# Altium schematic sheet big-auv-power.SchDoc
size A2
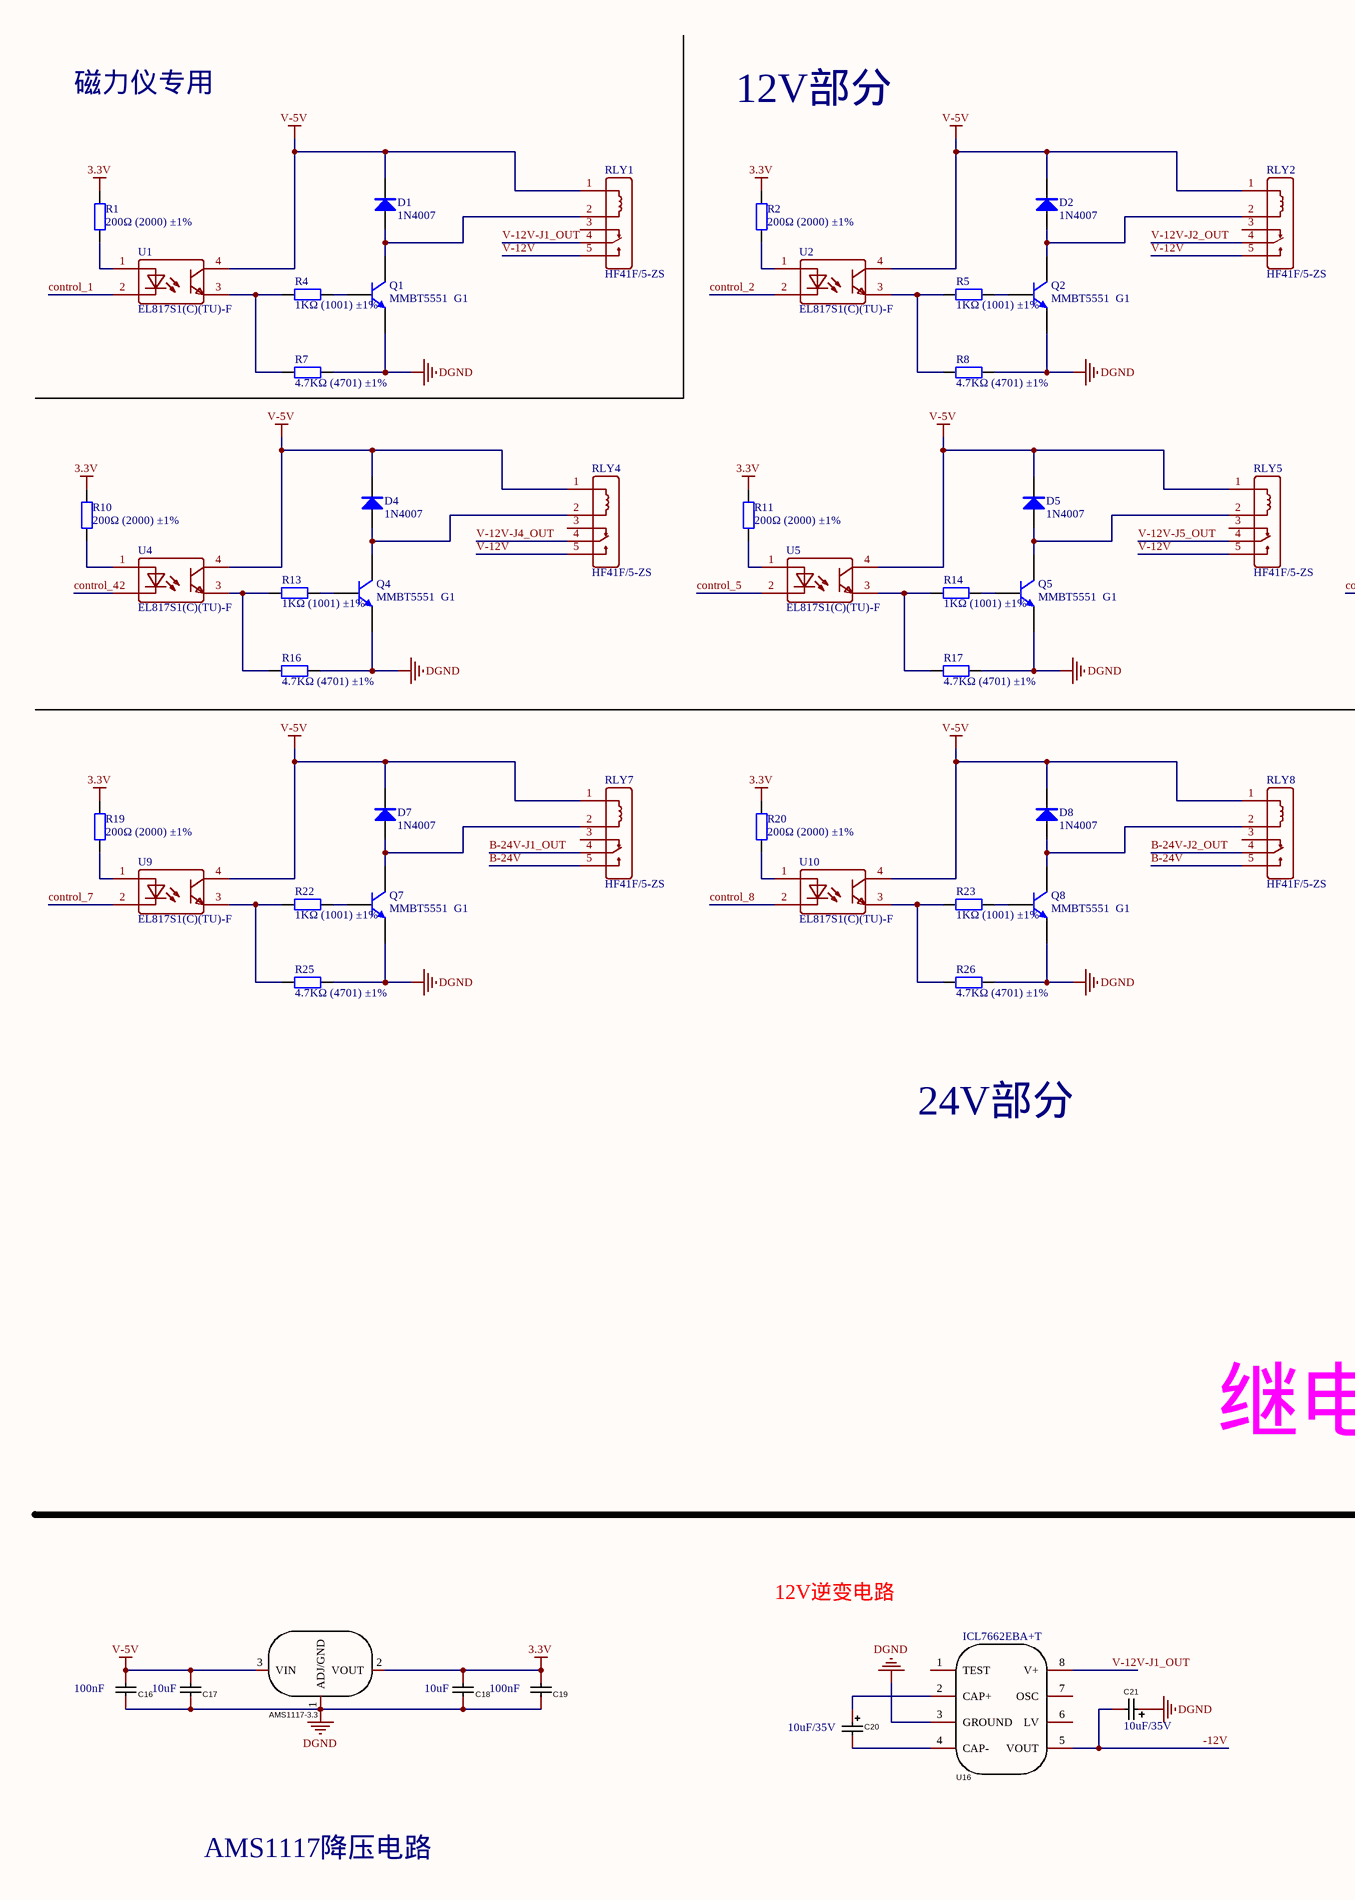
[diagram p0: big-auv-power.SchDoc, left]
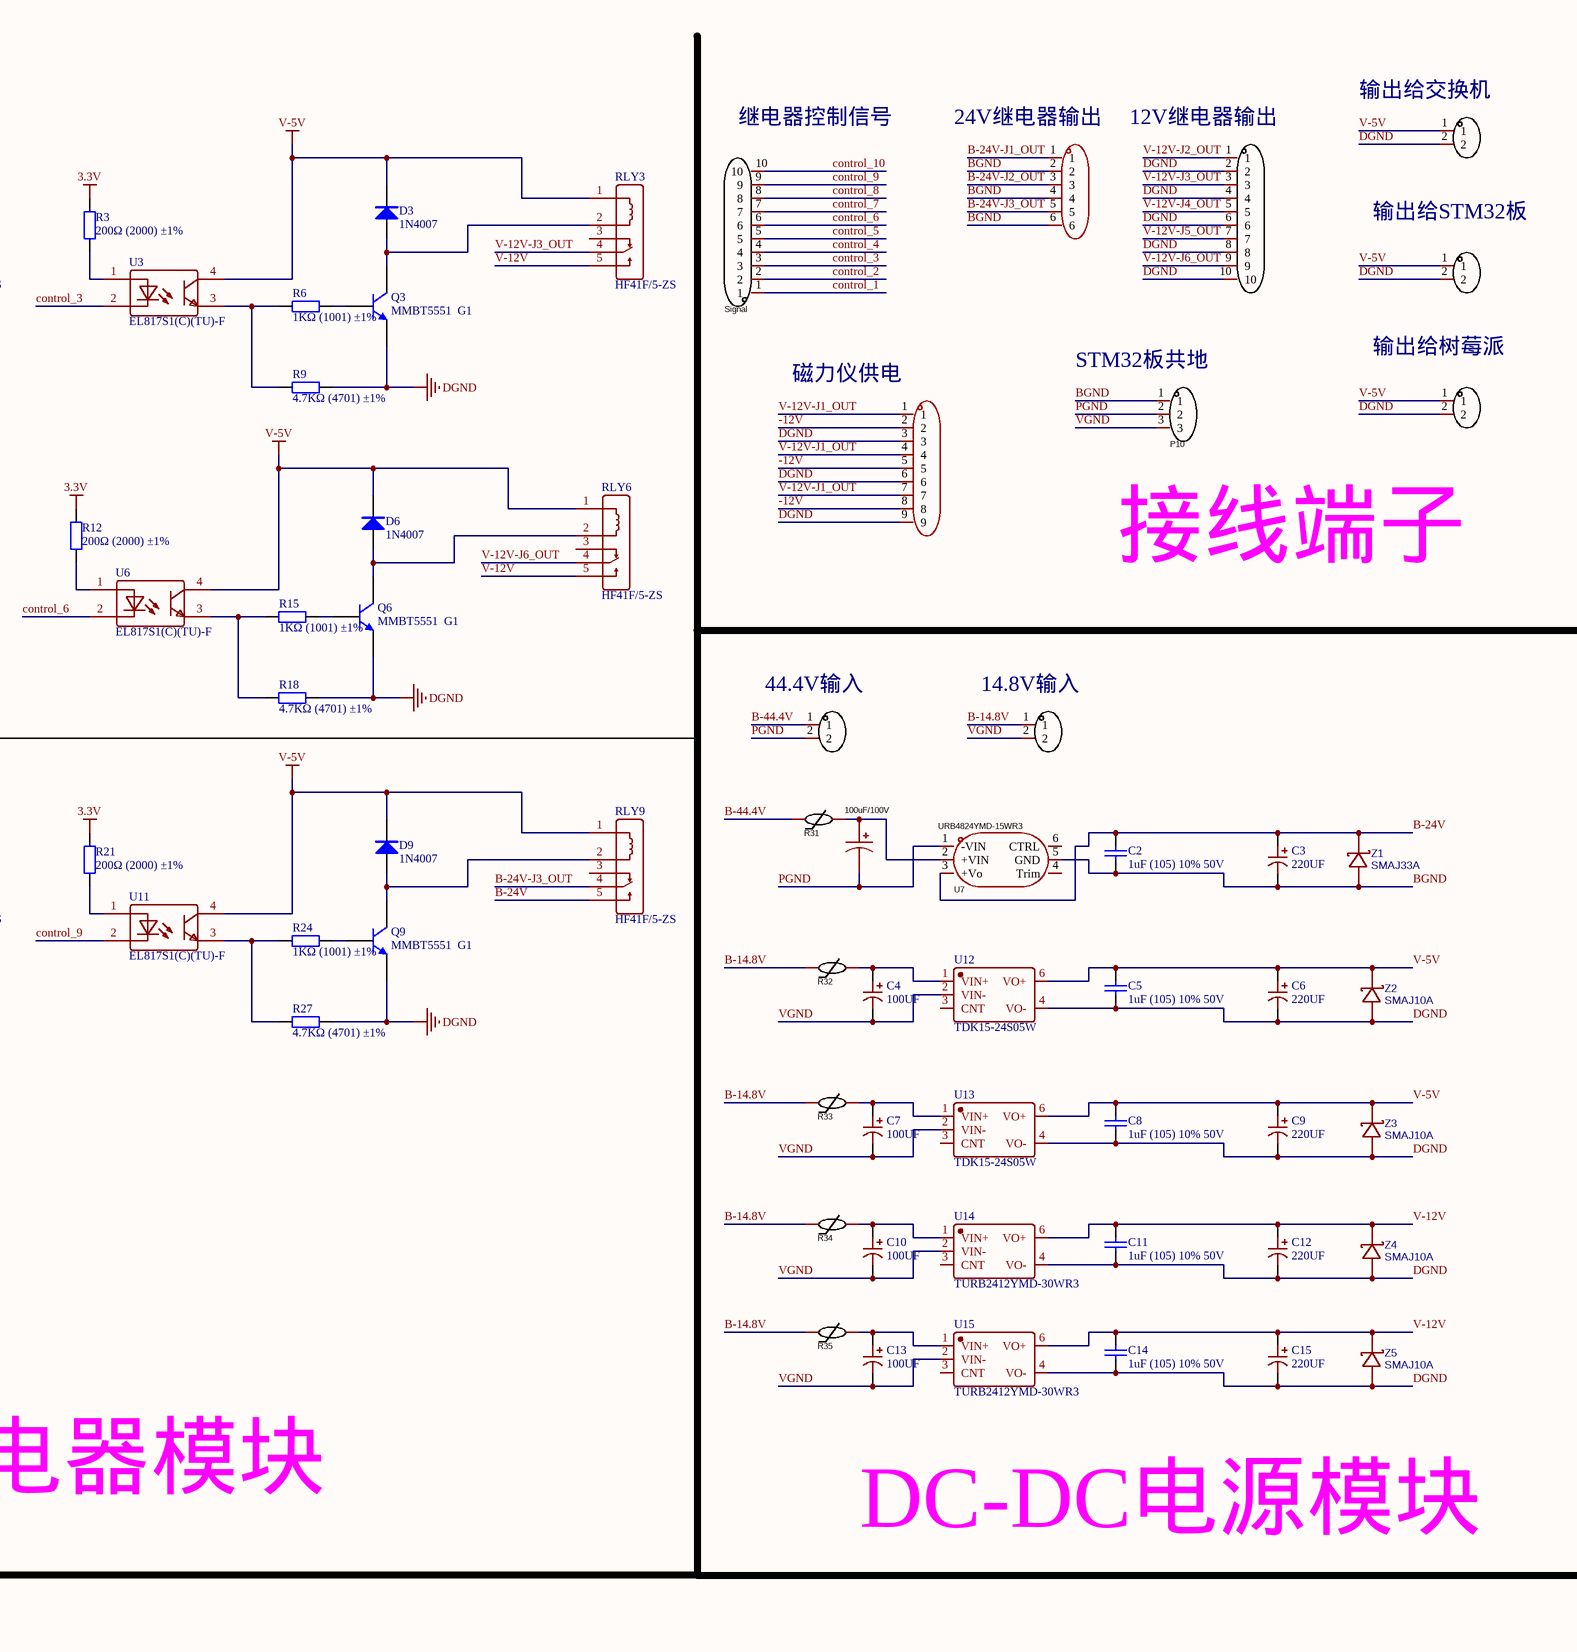
[diagram p1: big-auv-power.SchDoc, right]

## Parts
12V  KF2EDGR-3.5-10P  [CONN-TH_10P-P3.50_KF2EDGR-3.5-10P]  (value not drawn)
24V  KF2EDGR-3.5-6P  [CONN-TH_6P-P3.50_KF2EDGR-3.5-6P]  (value not drawn)
AMS1117-3.3  A1117-3.3  [SOT-223-3_L6.5-W3.4-P2.30-LS7.0-BR-1]  (value not drawn)
C1  100uF/100V  [CAP-SMD_BD12.5-L13.0-W13.0-FD-LS13.8]
C2  1uF (105) 10% 50V  [C0603]
C3  220UF  [SMD-C]
C4  100UF  [SMD-C]
C5  1uF (105) 10% 50V  [C0603]
C6  220UF  [SMD-C]
C7  100UF  [SMD-C]
C8  1uF (105) 10% 50V  [C0603]
C9  220UF  [SMD-C]
C10  100UF  [SMD-C]
C11  1uF (105) 10% 50V  [C0603]
C12  220UF  [SMD-C]
C13  100UF  [SMD-C]
C14  1uF (105) 10% 50V  [C0603]
C15  220UF  [SMD-C]
C16  100nF  [C0603]
C17  10uF  [C0603]
C18  10uF  [C0603]
C19  100nF  [C0603]
C20  10uF/35V  [CASE-C_6032]
C21  10uF/35V  [CASE-C_6032]
CILIYI  KF2EDGR-3.5-9P  [CONN-TH_9P-P3.50_KF2EDGR-3.5-9P]  (value not drawn)
D1  1N4007  [SMA(DO-214AC)_S2]
D2  1N4007  [SMA(DO-214AC)_S2]
D3  1N4007  [SMA(DO-214AC)_S2]
D4  1N4007  [SMA(DO-214AC)_S2]
D5  1N4007  [SMA(DO-214AC)_S2]
D6  1N4007  [SMA(DO-214AC)_S2]
D7  1N4007  [SMA(DO-214AC)_S2]
D8  1N4007  [SMA(DO-214AC)_S2]
D9  1N4007  [SMA(DO-214AC)_S2]
JP1  KF2EDGR-3.81-2P  [CONN-TH_2P-P3.81_KF2EDGR-3.81-2P]  (value not drawn)
JP2  KF2EDGR-3.81-2P  [CONN-TH_2P-P3.81_KF2EDGR-3.81-2P]  (value not drawn)
JP3  KF2EDGR-3.81-2P  [CONN-TH_2P-P3.81_KF2EDGR-3.81-2P]  (value not drawn)
P6  KF2EDGV-5.08-2P  [CONN-TH_P5.08_KF2EDGV-5.08-2P]  (value not drawn)
P7  KF2EDGV-5.08-2P  [CONN-TH_P5.08_KF2EDGV-5.08-2P]  (value not drawn)
P10  KF2EDGR-3.81-3P  [CONN-TH_3P-P3.81_KF2EDGR-3.81-3P]  (value not drawn)
Q1  MMBT5551  G1  [SOT-23-3_L2.9-W1.3-P1.90-LS2.4-BR]
Q2  MMBT5551  G1  [SOT-23-3_L2.9-W1.3-P1.90-LS2.4-BR]
Q3  MMBT5551  G1  [SOT-23-3_L2.9-W1.3-P1.90-LS2.4-BR]
Q4  MMBT5551  G1  [SOT-23-3_L2.9-W1.3-P1.90-LS2.4-BR]
Q5  MMBT5551  G1  [SOT-23-3_L2.9-W1.3-P1.90-LS2.4-BR]
Q6  MMBT5551  G1  [SOT-23-3_L2.9-W1.3-P1.90-LS2.4-BR]
Q7  MMBT5551  G1  [SOT-23-3_L2.9-W1.3-P1.90-LS2.4-BR]
Q8  MMBT5551  G1  [SOT-23-3_L2.9-W1.3-P1.90-LS2.4-BR]
Q9  MMBT5551  G1  [SOT-23-3_L2.9-W1.3-P1.90-LS2.4-BR]
R1  200Ω (2000) ±1%  [R0603]
R2  200Ω (2000) ±1%  [R0603]
R3  200Ω (2000) ±1%  [R0603]
R4  1KΩ (1001) ±1%  [R0603]
R5  1KΩ (1001) ±1%  [R0603]
R6  1KΩ (1001) ±1%  [R0603]
R7  4.7KΩ (4701) ±1%  [R0603]
R8  4.7KΩ (4701) ±1%  [R0603]
R9  4.7KΩ (4701) ±1%  [R0603]
R10  200Ω (2000) ±1%  [R0603]
R11  200Ω (2000) ±1%  [R0603]
R12  200Ω (2000) ±1%  [R0603]
R13  1KΩ (1001) ±1%  [R0603]
R14  1KΩ (1001) ±1%  [R0603]
R15  1KΩ (1001) ±1%  [R0603]
R16  4.7KΩ (4701) ±1%  [R0603]
R17  4.7KΩ (4701) ±1%  [R0603]
R18  4.7KΩ (4701) ±1%  [R0603]
R19  200Ω (2000) ±1%  [R0603]
R20  200Ω (2000) ±1%  [R0603]
R21  200Ω (2000) ±1%  [R0603]
R22  1KΩ (1001) ±1%  [R0603]
R23  1KΩ (1001) ±1%  [R0603]
R24  1KΩ (1001) ±1%  [R0603]
R25  4.7KΩ (4701) ±1%  [R0603]
R26  4.7KΩ (4701) ±1%  [R0603]
R27  4.7KΩ (4701) ±1%  [R0603]
R31  MF72 22D9  [RES-TH_L12.5-W5.1-P7.50-D1.2-S2.20]  (value not drawn)
R32  MF72 22D9  [RES-TH_L12.5-W5.1-P7.50-D1.2-S2.20]  (value not drawn)
R33  MF72 22D9  [RES-TH_L12.5-W5.1-P7.50-D1.2-S2.20]  (value not drawn)
R34  MF72 22D9  [RES-TH_L12.5-W5.1-P7.50-D1.2-S2.20]  (value not drawn)
R35  MF72 22D9  [RES-TH_L12.5-W5.1-P7.50-D1.2-S2.20]  (value not drawn)
RLY1  HF41F/5-ZS  [HF41F/5-ZS]
RLY2  HF41F/5-ZS  [HF41F/5-ZS]
RLY3  HF41F/5-ZS  [HF41F/5-ZS]
RLY4  HF41F/5-ZS  [HF41F/5-ZS]
RLY5  HF41F/5-ZS  [HF41F/5-ZS]
RLY6  HF41F/5-ZS  [HF41F/5-ZS]
RLY7  HF41F/5-ZS  [HF41F/5-ZS]
RLY8  HF41F/5-ZS  [HF41F/5-ZS]
RLY9  HF41F/5-ZS  [HF41F/5-ZS]
Signal  KF2EDGR-3.5-10P  [CONN-TH_10P-P3.50_KF2EDGR-3.5-10P]  (value not drawn)
U1  EL817S1(C)(TU)-F  [EL817S1(C)(TU)-F]
U2  EL817S1(C)(TU)-F  [EL817S1(C)(TU)-F]
U3  EL817S1(C)(TU)-F  [EL817S1(C)(TU)-F]
U4  EL817S1(C)(TU)-F  [EL817S1(C)(TU)-F]
U5  EL817S1(C)(TU)-F  [EL817S1(C)(TU)-F]
U6  EL817S1(C)(TU)-F  [EL817S1(C)(TU)-F]
U7  URB4824YMD-15WR3  [PWRM-TH_YLPTEC_URBXXXXYMD-15WR3]
U9  EL817S1(C)(TU)-F  [EL817S1(C)(TU)-F]
U10  EL817S1(C)(TU)-F  [EL817S1(C)(TU)-F]
U11  EL817S1(C)(TU)-F  [EL817S1(C)(TU)-F]
U12  TDK15-24S05W  [TDK15-24S05]
U13  TDK15-24S05W  [TDK15-24S05]
U14  TURB2412YMD-30WR3  [TDK15-24S05]
U15  TURB2412YMD-30WR3  [TDK15-24S05]
U16  ICL7662EBA+T  [SOIC-8_L5.0-W4.0-P1.27-LS6.0-BL]
Z1  SMAJ33A  [SMA(DO-214AC)]
Z2  SMAJ10A  [SMA(DO-214AC)]
Z3  SMAJ10A  [SMA(DO-214AC)]
Z4  SMAJ10A  [SMA(DO-214AC)]
Z5  SMAJ10A  [SMA(DO-214AC)]

## Nets
3.3V: AMS1117-3.3.2(VOUT) C18.2 C19.2 R1.2 R2.2 R3.2 R10.2 R11.2 R12.2 R19.2 R20.2 R21.2
DGND: 12V.2 12V.4 12V.6 12V.8 12V.10 AMS1117-3.3.1(ADJ/GND) C5.2 C6.2 C8.2 C9.2 C11.2 C12.2 C14.2 C15.2 C16.2 C17.2 C18.1 C19.1 C21.1 CILIYI.3 CILIYI.6 CILIYI.9 JP1.2 JP2.2 JP3.2 Q1.2(E) Q2.2(E) Q3.2(E) Q4.2(E) Q5.2(E) Q6.2(E) Q7.2(E) Q8.2(E) Q9.2(E) R7.2 R8.2 R9.2 R16.2 R17.2 R18.2 R25.2 R26.2 R27.2 U12.4(VO-) U13.4(VO-) U14.4(VO-) U15.4(VO-) U16.3(GROUND) Z2.1(A) Z3.1(A) Z4.1(A) Z5.1(A)
V-5V: AMS1117-3.3.3(VIN) C5.1 C6.1 C8.1 C9.1 C16.1 C17.1 D1.2(K) D2.2(K) D3.2(K) D4.2(K) D5.2(K) D6.2(K) D7.2(K) D8.2(K) D9.2(K) JP1.1 JP2.1 JP3.1 RLY1.1(COIL) RLY2.1(COIL) RLY3.1(COIL) RLY4.1(COIL) RLY5.1(COIL) RLY6.1(COIL) RLY7.1(COIL) RLY8.1(COIL) RLY9.1(COIL) U1.4(COL) U2.4(COL) U3.4(COL) U4.4(COL) U5.4(COL) U6.4(COL) U9.4(COL) U10.4(COL) U11.4(COL) U12.6(VO+) U13.6(VO+) Z2.2(K) Z3.2(K)
-12V: C21.2 CILIYI.2 CILIYI.5 CILIYI.8 U16.5(VOUT)
B-14.8V: P7.1 R32.1 R33.1 R34.1 R35.1
B-24V: C2.1 C3.1 RLY7.5(NO) RLY8.5(NO) RLY9.5(NO) U7.3(+Vo) Z1.2(K)
B-24V-J1_OUT: 24V.1 RLY7.4(COM)
B-24V-J2_OUT: 24V.3 RLY8.4(COM)
B-24V-J3_OUT: 24V.5 RLY9.4(COM)
B-44.4V: P6.1 R31.1
BGND: 24V.2 24V.4 24V.6 C2.2 C3.2 P10.1 U7.5(GND) Z1.1(A)
control_1: Signal.1 U1.2(CAT)
control_2: Signal.2 U2.2(CAT)
control_3: Signal.3 U3.2(CAT)
control_4: Signal.4 U4.2(CAT)
control_5: Signal.5 U5.2(CAT)
control_6: Signal.6 U6.2(CAT)
control_7: Signal.7 U9.2(CAT)
control_8: Signal.8 U10.2(CAT)
control_9: Signal.9 U11.2(CAT)
control_10: Signal.10
PGND: C1.2 P6.2 P10.2 U7.1(-VIN)
V-12V: C11.1 C12.1 C14.1 C15.1 RLY1.5(NO) RLY2.5(NO) RLY3.5(NO) RLY4.5(NO) RLY5.5(NO) RLY6.5(NO) U14.6(VO+) U15.6(VO+) Z4.2(K) Z5.2(K)
V-12V-J1_OUT: CILIYI.1 CILIYI.4 CILIYI.7 RLY1.4(COM) U16.8(V+)
V-12V-J2_OUT: 12V.1 RLY2.4(COM)
V-12V-J3_OUT: 12V.3 RLY3.4(COM)
V-12V-J4_OUT: 12V.5 RLY4.4(COM)
V-12V-J5_OUT: 12V.7 RLY5.4(COM)
V-12V-J6_OUT: 12V.9 RLY6.4(COM)
VGND: C4.2 C7.2 C10.2 C13.2 P7.2 P10.3 U12.2(VIN-) U13.2(VIN-) U14.2(VIN-) U15.2(VIN-)
NetC1_1: C1.1 R31.2 U7.2(+VIN)
NetC4_1: C4.1 R32.2 U12.1(VIN+)
NetC7_1: C7.1 R33.2 U13.1(VIN+)
NetC10_1: C10.1 R34.2 U14.1(VIN+)
NetC13_1: C13.1 R35.2 U15.1(VIN+)
NetC20_1: C20.1 U16.2(CAP+)
NetC20_2: C20.2 U16.4(CAP-)
NetD1_1: D1.1(A) Q1.3(C) RLY1.2(COIL)
NetD2_1: D2.1(A) Q2.3(C) RLY2.2(COIL)
NetD3_1: D3.1(A) Q3.3(C) RLY3.2(COIL)
NetD4_1: D4.1(A) Q4.3(C) RLY4.2(COIL)
NetD5_1: D5.1(A) Q5.3(C) RLY5.2(COIL)
NetD6_1: D6.1(A) Q6.3(C) RLY6.2(COIL)
NetD7_1: D7.1(A) Q7.3(C) RLY7.2(COIL)
NetD8_1: D8.1(A) Q8.3(C) RLY8.2(COIL)
NetD9_1: D9.1(A) Q9.3(C) RLY9.2(COIL)
NetQ1_1: Q1.1(B) R4.2
NetQ2_1: Q2.1(B) R5.2
NetQ3_1: Q3.1(B) R6.2
NetQ4_1: Q4.1(B) R13.2
NetQ5_1: Q5.1(B) R14.2
NetQ6_1: Q6.1(B) R15.2
NetQ7_1: Q7.1(B) R22.2
NetQ8_1: Q8.1(B) R23.2
NetQ9_1: Q9.1(B) R24.2
NetR1_1: R1.1 U1.1(AN)
NetR2_1: R2.1 U2.1(AN)
NetR3_1: R3.1 U3.1(AN)
NetR4_1: R4.1 R7.1 U1.3(EM)
NetR5_1: R5.1 R8.1 U2.3(EM)
NetR6_1: R6.1 R9.1 U3.3(EM)
NetR10_1: R10.1 U4.1(AN)
NetR11_1: R11.1 U5.1(AN)
NetR12_1: R12.1 U6.1(AN)
NetR13_1: R13.1 R16.1 U4.3(EM)
NetR14_1: R14.1 R17.1 U5.3(EM)
NetR15_1: R15.1 R18.1 U6.3(EM)
NetR19_1: R19.1 U9.1(AN)
NetR20_1: R20.1 U10.1(AN)
NetR21_1: R21.1 U11.1(AN)
NetR22_1: R22.1 R25.1 U9.3(EM)
NetR23_1: R23.1 R26.1 U10.3(EM)
NetR24_1: R24.1 R27.1 U11.3(EM)

Not connected (* = marked no-connect by the designer): RLY1 3(NC); RLY2 3(NC); RLY3 3(NC); RLY4 3(NC); RLY5 3(NC); RLY6 3(NC); RLY7 3(NC); RLY8 3(NC); RLY9 3(NC); U7 4(Trim) 6(CTRL); U12 3(CNT); U13 3(CNT); U14 3(CNT); U15 3(CNT); U16 1(TEST) 6(LV) 7(OSC)

## Notes on the sheet
- 磁力仪专用
- 12V部分
- (near JP1) 输出给交换机
- (near Signal) 继电器控制信号
- (near 24V) 24V继电器输出
- (near 12V) 12V继电器输出
- 输出给STM32板
- 磁力仪供电
- (near P10) STM32板共地
- 输出给树莓派
- (near P10) 接线端子
- (near P6) 44.4V输入
- (near P7) 14.8V输入
- 24V部分
- 继电器模块
- DC-DC电源模块
- 12V逆变电路
- AMS1117降压电路

## Library data of the parts
12V Signal = KF2EDGR-3.5-10P: Manufacturer: KEFA(科发); Add into BOM: yes; Connector Type: 板端/插座-闭口; Structure: 1x10P; Pitch: 3.5mm; Number of PINs Per Row: 10; Current Rating (Max): 8A; Voltage Rating (Max): 300V; Name: KF2EDGR-3.5-10P; Symbol: KF2EDGR-3.5-10P; Device: KF2EDGR-3.5-10P; LCSC Part Name: 3.5mm 1x10P 排数:1 每排P数:10; Supplier Part: C441168; Manufacturer Part: KF2EDGR-3.5-10P; Supplier Footprint: 弯插,P=3.5mm; JLCPCB Part Class: Extended Part; Datasheet: https://atta.szlcsc.com/upload/public/pdf/source/20230331/72E4E5AAB7D73656319D871C62219080.pdf; Supplier: LCSC; Convert to PCB: yes; Color: 绿色; Mounting Style: 弯针; Number of Pins: 10P; Number of Rows: 1; Operating Temperature Range: -40℃~+105℃
24V = KF2EDGR-3.5-6P: Manufacturer: KEFA(科发); Add into BOM: yes; Connector Type: 板端/插座-闭口; Structure: 1x6P; Pitch: 3.5mm; Number of PINs Per Row: 6; Current Rating (Max): 10A; Voltage Rating (Max): 300V; Symbol: KF2EDGR-3.5-6P; Device: KF2EDGR-3.5-6P; LCSC Part Name: 1x6P 3.5mm 排数:1 每排P数:6; Supplier Part: C441175; Manufacturer Part: KF2EDGR-3.5-6P; Supplier Footprint: 弯插,P=3.5mm; JLCPCB Part Class: Extended Part; Datasheet: https://atta.szlcsc.com/upload/public/pdf/source/20230331/72E4E5AAB7D73656319D871C62219080.pdf; Supplier: LCSC; Convert to PCB: yes; fixed form: -; Color: 绿色; Mounting Style: 弯针; Number of Pins: 6P; Number of Rows: 1; Wire Gauge - AWG: -; Wire Gauge - mm2: -; Contact Material: 铜合金; Contact Plating: 锡; Operating Temperature Range: -40℃~+105℃; Soldering Temperature(Max): -; Connection Type: -; Outlet Direction (Vertical Basis): -
AMS1117-3.3 = AMS1117-3.3: Manufacturer: IDCHIP(英锐芯); Add into BOM: yes; Name: A1117-3.3; Symbol: A1117-3.3; Device: A1117-3.3; LCSC Part Name: AMS1117-3.3; Supplier Part: C7432020; Manufacturer Part: A1117-3.3; Supplier Footprint: SOT-223; Datasheet: https://atta.szlcsc.com/upload/public/pdf/source/20230625/435FEEFA02C0FE449E7397A11F8448E0.pdf; Supplier: LCSC; Convert to PCB: yes; link: https://atta.szlcsc.com/upload/public/pdf/source/20230625/435FEEFA02C0FE449E7397A11F8448E0.pdf
C1 = RVT2A101M1213: 100uF 100V电解电容; Manufacturer: ROQANG(容强); Add into BOM: yes; Tolerance: ±20%; Rated Voltage: 100V; Ripple Current: 280mA@120Hz; φD: 12.5mm; L: 13.5mm; Lifetime @ Temp: 2000hrs@105℃; Symbol: RVT2A101M1213; Device: RVT2A101M1213; LCSC Part Name: 100uF ±20% 100V; Supplier Part: C2992302; Manufacturer Part: RVT2A101M1213; Supplier Footprint: SMD,D12.5xL13.5mm; JLCPCB Part Class: Extended Part; Datasheet: https://atta.szlcsc.com/upload/public/pdf/source/20181128/C335987_23CA7AA50FB42690DF736C43FE112376.pdf; Supplier: LCSC; Convert to PCB: yes; Value: 100uF; Operating Temperature: -40℃~+105℃
C2 C5 C8 C11 C14 = 0603 1uF (105) 10% 50V: 贴片电容; ComponentLink1Description: 供应商链接; ComponentLink1URL: http://www.szlcsc.com/product/details_16531.html; Package: 0603; Supplier: LC; SuppliersPartNumber: C15849
C16 C19 = 0603B104K500NT: 0603电容; Manufacturer: FH(风华); Add into BOM: yes; Tolerance: ±10%; Voltage Rated: 50V; Temperature Coefficient: X7R; Name: 100nF; Symbol: 0603B104K500NT; Device: 0603B104K500NT; LCSC Part Name: 100nF ±10% 50V; Supplier Part: C30926; Manufacturer Part: 0603B104K500NT; Supplier Footprint: 0603; JLCPCB Part Class: Extended Part; Datasheet: https://atta.szlcsc.com/upload/public/pdf/source/20170923/C30926_1506149436298988724.pdf; Supplier: LCSC; Convert to PCB: yes; Value: 100nF
C17 C18 = 0603B104K500NT: 0603电容; Manufacturer: FH(风华); Name: 100nF; Add into BOM: yes; Value: 100nF; Tolerance: ±10%; Voltage Rated: 50V; Temperature Coefficient: X7R; Symbol: 0603B104K500NT; Device: 0603B104K500NT; LCSC Part Name: 100nF ±10% 50V; Supplier Part: C30926; Manufacturer Part: 0603B104K500NT; Supplier Footprint: 0603; JLCPCB Part Class: Extended Part; Datasheet: https://atta.szlcsc.com/upload/public/pdf/source/20170923/C30926_1506149436298988724.pdf; Supplier: LCSC; Convert to PCB: yes
C20 C21 = TAJC106K035RNJ: 10uF/35V钽电容; Manufacturer: Kyocera AVX; Name: 10uF; Add into BOM: yes; Value: 10uF; Tolerance: ±10%; Rated Voltage: 35V; Equivalent Series Resistance(ESR): 1.6Ω@100kHz; Symbol: TAJC106K035RNJ; Device: TAJC106K035RNJ; LCSC Part Name: 10uF ±10% 35V; Supplier Part: C7211; Manufacturer Part: TAJC106K035RNJ; Supplier Footprint: CASE-C_6032; JLCPCB Part Class: Extended Part; Datasheet: https://atta.szlcsc.com/upload/public/pdf/source/20160107/1457707749174.pdf; Supplier: LCSC; Convert to PCB: yes; Operating Temperature: -55℃~+125℃
CILIYI = KF2EDGR-3.5-9P: Manufacturer: KEFA(科发); Add into BOM: yes; Connector Type: 板端/插座-闭口; Structure: 1x9P; Pitch: 3.5mm; Number of PINs Per Row: 9; Current Rating (Max): 10A; Voltage Rating (Max): 300V; Symbol: KF2EDGR-3.5-9P; Device: KF2EDGR-3.5-9P; LCSC Part Name: 1x9P 3.5mm 排数:1 每排P数:9; Supplier Part: C441178; Manufacturer Part: KF2EDGR-3.5-9P; Supplier Footprint: 弯插,P=3.5mm; JLCPCB Part Class: Extended Part; Datasheet: https://atta.szlcsc.com/upload/public/pdf/source/20230331/72E4E5AAB7D73656319D871C62219080.pdf; Supplier: LCSC; Convert to PCB: yes; fixed form: -; Color: 绿色; Mounting Style: 弯针; Number of Pins: 9P; Number of Rows: 1; Wire Gauge - AWG: -; Wire Gauge - mm2: -; Contact Material: 铜合金; Contact Plating: 锡; Operating Temperature Range: -40℃~+105℃; Soldering Temperature(Max): -; Connection Type: -; Outlet Direction (Vertical Basis): -
D1-D9 = 1N4007: 整流二极管; 版权归属: 源创客; BOM名称: 整流二极管; 学习资源: www.ooocke.com
JP1-JP3 = KF2EDGR-3.81-2P: Manufacturer: KEFA(科发); Add into BOM: yes; Connector Type: 板端/插座-闭口; Structure: 1x2P; Pitch: 3.81mm; Number of PINs Per Row: 2; Current Rating (Max): 8A; Voltage Rating (Max): 300V; Name: KF2EDGR-3.81-2P; Symbol: KF2EDGR-3.81-2P; Device: KF2EDGR-3.81-2P; LCSC Part Name: 板端/插座-闭口 1x2P 3.81mm 排数:1 每排P数:2 弯针; Supplier Part: C441182; Manufacturer Part: KF2EDGR-3.81-2P; Supplier Footprint: 弯插,P=3.81mm; JLCPCB Part Class: Extended Part; Datasheet: https://atta.szlcsc.com/upload/public/pdf/source/20230331/6258E6C6BF04EFF922F3E5A9E72A4547.pdf; Supplier: LCSC; Convert to PCB: yes; Number of Rows: 1; Mounting Style: 弯针; Operating Temperature Range: -40℃~+105℃; Color: 绿色
P6 P7 = KF2EDGV-5.08-2P: Manufacturer: KEFA(科发); Add into BOM: yes; Connector Type: 板端/插座-开口; Pitch: 5.08mm; Structure: 1x2P; Number of PINs Per Row: 2; Current Rating (Max): 15A; Voltage Rating (Max): 300V; Name: KF2EDGV-5.08-2P; Symbol: KF2EDGV-5.08-2P; Device: KF2EDGV-5.08-2P; LCSC Part Name: 5.08mm 1x2P 排数:1 每排P数:2; Supplier Part: C441354; Manufacturer Part: KF2EDGV-5.08-2P; Supplier Footprint: 插件,P=5.08mm; JLCPCB Part Class: Extended Part; Datasheet: https://atta.szlcsc.com/upload/public/pdf/source/20230331/07EACEF7A0E6B8900C77AF4F304A3561.pdf; Supplier: LCSC; Convert to PCB: yes; Number of Rows: 1; Number of Pins: 2P; Operating Temperature Range: -40℃~+105℃; Color: 绿色; Mounting Style: 直针
P10 = KF2EDGR-3.81-3P: Manufacturer: KEFA(科发); Add into BOM: yes; Connector Type: 板端/插座-闭口; Pitch: 3.81mm; Number of PINs Per Row: 3; Current Rating (Max): 8A; Voltage Rating (Max): 300V; Name: KF2EDGR-3.81-3P; Symbol: KF2EDGR-3.81-3P; Device: KF2EDGR-3.81-3P; LCSC Part Name: 板端/插座-闭口 3.81mm 排数:1 每排P数:3 弯针; Supplier Part: C441183; Manufacturer Part: KF2EDGR-3.81-3P; Supplier Footprint: P=3.81mm; JLCPCB Part Class: Extended Part; Datasheet: https://atta.szlcsc.com/upload/public/pdf/source/20191023/C441183_0DEFA45C98AD039C055774507C9A3105.pdf; Supplier: LCSC; Convert to PCB: yes; Number of Rows: 1; Mounting Style: 弯针; Wire Gauge - AWG: -; Wire Gauge - mm?: -; Operating Temperature Range: -40℃~+105℃; Color: 绿色
Q1-Q9 = SOT-23 MMBT5551  G1: 三极管; ComponentLink1Description: 供应商链接; ComponentLink1URL: http://www.szlcsc.com/product/details_2502.html; Package: SOT-23; Supplier: LC; SuppliersPartNumber: C2145
R1-R3 R10-R12 R19-R21 = 0603 200Ω (2000) 1%: 贴片电阻; ComponentLink1Description: 供应商链接; ComponentLink1URL: http://www.szlcsc.com/product/details_8708.html; Package: 0603; Supplier: LC; SuppliersPartNumber: C8218
R4-R6 R13-R15 R22-R24 = 0603 1KΩ (1001) 1%: 贴片电阻; ComponentLink1Description: 供应商链接; ComponentLink1URL: http://www.szlcsc.com/product/details_21904.html; Package: 0603; Supplier: LC; SuppliersPartNumber: C21190
R7-R9 R16-R18 R25-R27 = 0603 4.7KΩ (4701) 1%: 贴片电阻; ComponentLink1Description: 供应商链接; ComponentLink1URL: http://www.szlcsc.com/product/details_23889.html; Package: 0603; Supplier: LC; SuppliersPartNumber: C23162
R31-R35 = MF72 22D9: NTC热敏电阻; Manufacturer: 时恒; Symbol: 22Ω ±20%; Add into BOM: yes; Resistance @ 25℃: 22Ω; Resistance Tolerance: ±20%; B Constant Tolerance: ±10%; B Constant (25℃/50℃): 3000K; Power: 2W; Steady State Current (Max): 1A; Name: MF72 22D9; Device: MF72 22D9; LCSC Part Name: 22Ω 电阻精度:±20% 3000K; Supplier Part: C122769; Manufacturer Part: MF72 22D9; Supplier Footprint: 插件,P=7.5mm; JLCPCB Part Class: Extended Part; Datasheet: https://atta.szlcsc.com/upload/public/pdf/source/20170721/C122769_1500627493180835245.pdf; Supplier: LCSC; Convert to PCB: yes; B Constant (25℃/75℃): -; B Constant (25℃/85℃): -; B Constant (25℃/100℃): -; Operating Temperature: -40℃~+170℃
U7 = URB4824YMD-15WR3_C5369771: 48V转24V降压模块; Manufacturer: YLPTEC(易川); Add into BOM: yes; Number of channel: 1; Power: 15W; input voltage (Vdc): 18V~75V; Conversion Efficiency: 91%; Output Voltage: 24V; Output Current (Max): 625mA; Maximum Capacitive Load: 500uF; Insulated Voltage: 1500V; Protective function: 短路保护；低功耗; Symbol: URB4824YMD-15WR3_C5369771; Device: URB4824YMD-15WR3_C5369771; LCSC Part Name: URB4824YMD-15WR3; Supplier Part: C5369771; Manufacturer Part: URB4824YMD-15WR3; Supplier Footprint: DIP,25.4x25.4mm; JLCPCB Part Class: Extended Part; Datasheet: https://atta.szlcsc.com/upload/public/pdf/source/20231130/0497741960D4F90C7DF23765F9967964.pdf; Supplier: LCSC; Convert to PCB: yes; TYPE: -
U12-U15 = TDK15-24S05
U16 = ICL7662EBA+T: 宽幅电压逆变; Manufacturer: ADI(亚德诺)/MAXIM(美信); Add into BOM: yes; Synchronous Rectification: 否; Output Type: 固定; Number of Outputs: 1; Input Voltage: 4.5V~20V; Switching Frequency: 10kHz; Name: ICL7662EBA+T; Symbol: ICL7662EBA; Device: ICL7662EBA+T; LCSC Part Name: ICL7662EBA+T; Supplier Part: C28595; Manufacturer Part: ICL7662EBA+T; Supplier Footprint: SOP-8; JLCPCB Part Class: Extended Part; Datasheet: https://atta.szlcsc.com/upload/public/pdf/source/20180803/C242528_35C2419E4C13BFD84D6327AC96256493.pdf; Supplier: LCSC; Convert to PCB: yes; Operating Temperature: -40℃~+85℃@(TA)
Z1-Z5 = SMBJ10A: TVS二极管; BOM_Manufacturer: Littelfuse; Contributor: LCSC; SMT Type: Extend; BOM_Supplier: LCSC; BOM_Supplier Part: C151250; BOM_Manufacturer Part: SMBJ10A; BOM_LCSC Assembly: Yes; spicePre: D; Value: SMBJ10A; URL: https://item.szlcsc.com/162590.html